# EAGLE schematic scheme (EAGLE 5.11)
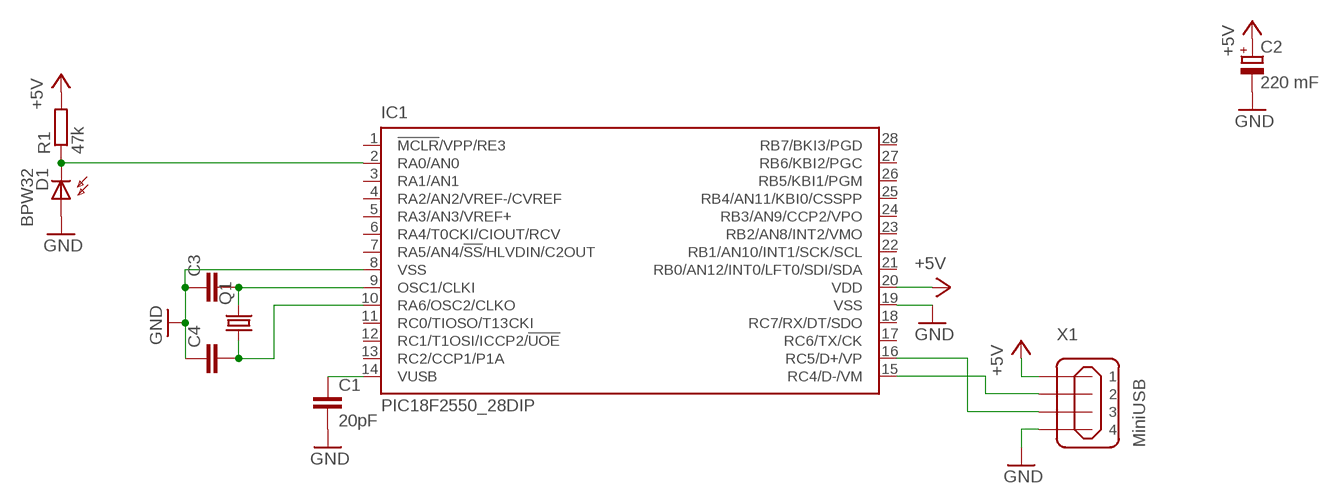
[diagram p0: schematic, sheet 1]

## Parts
C1  20pF  C-EU025-025X050  [C025-025X050]
C2  220 mF  CPOL-EUE2.5-6  [E2,5-6]
C3  C-EU025-025X050  [C025-025X050]
C4  C-EU025-025X050  [C025-025X050]
D1  BPW32  [BPW32]
IC1  PIC18F2550_28DIP  [DIL28-3]
Q1  CRYSTALHC49S  [HC49/S]
R1  47k  R-EU_0204/7  [0204/7]
X1  MiniUSB  MINI-USB_SHIELD4P-85-32004-00X  [85-32004-00X]

## Nets
+5V: C2.+ IC1.20(VDD) R1.2 X1.1
GND: C1.2 C2.- C3.1 C4.1 D1.A IC1.8(VSS) IC1.19(VSS) X1.4
N$1: D1.K(C) IC1.2(RA0/AN0) R1.1
N$2: C1.1 IC1.14(VUSB)
N$3: IC1.15(RC4/D-/VM) X1.2
N$4: IC1.16(RC5/D+/VP) X1.3
N$5: C4.2 IC1.10(RA6/OSC2/CLKO) Q1.1
N$6: C3.2 IC1.9(OSC1/CLKI) Q1.2
Unconnected: IC1.1(!MCLR!/VPP/RE3) IC1.3(RA1/AN1) IC1.4(RA2/AN2/VREF-/CVREF) IC1.5(RA3/AN3/VREF+) IC1.6(RA4/T0CKI/CIOUT/RCV) IC1.7(RA5/AN4/!SS!/HLVDIN/C2OUT) IC1.11(RC0/TIOSO/T13CKI) IC1.12(RC1/T1OSI/ICCP2/!UOE) IC1.13(RC2/CCP1/P1A) IC1.17(RC6/TX/CK) IC1.18(RC7/RX/DT/SDO) IC1.21(RB0/AN12/INT0/LFT0/SDI/SDA) IC1.22(RB1/AN10/INT1/SCK/SCL) IC1.23(RB2/AN8/INT2/VMO) IC1.24(RB3/AN9/CCP2/VPO) IC1.25(RB4/AN11/KBI0/CSSPP) IC1.26(RB5/KBI1/PGM) IC1.27(RB6/KBI2/PGC) IC1.28(RB7/BKI3/PGD) X1.M1(S1) X1.M2(S2)

## Library data of the parts
C1 C3 C4 = rcl:C-EU: CAPACITOR, European symbol
C2 = rcl:CPOL-EU: POLARIZED CAPACITOR, European symbol
D1 = opto-trans-siemens:BPW32: PHOTO DIODE; OC_FARNELL: unknown; OC_NEWARK: unknown
IC1 = microchip:PIC18F2*_28: USB Microcontrollers with nanoWatt Technology High-Performance, Enhanced Flash, 28/40/44-Pin, Source: http://ww1.microchip.com/downloads/en/devicedoc/39632c.pdf; MF: MICROCHIP; MPN: PIC18F2550-I/SP; OC_FARNELL: 1523822; OC_NEWARK: 80K6054
Q1 = crystal:CRYSTAL: CRYSTAL; OC_FARNELL: 1667008; OC_NEWARK: unknown
R1 = rcl:R-EU_: RESISTOR, European symbol
X1 = con-cypressindustries:MINI-USB_SHIELD4P-: MINI USB 4 Pol. Source: www.cypressindustries.com; OC_FARNELL: unknown; OC_NEWARK: unknown